# Altium schematic sheet Filters.SchDoc: Sample Sheet Title
size B; Date: MM/DD/YYYY; Author: Sample Author; Organization: ORGANIZATION; Address1: ADDRESS 1; Address2: ADDRESS 2; Address3: ADDRESS 3; Address4: ADDRESS 4; Revision: -; SheetNumber: 2; SheetTotal: 2; ENG_APP_DATE: --/--/--; DSN_APP_DATE: --/--/--; CHK_APP_DATE: --/--/--
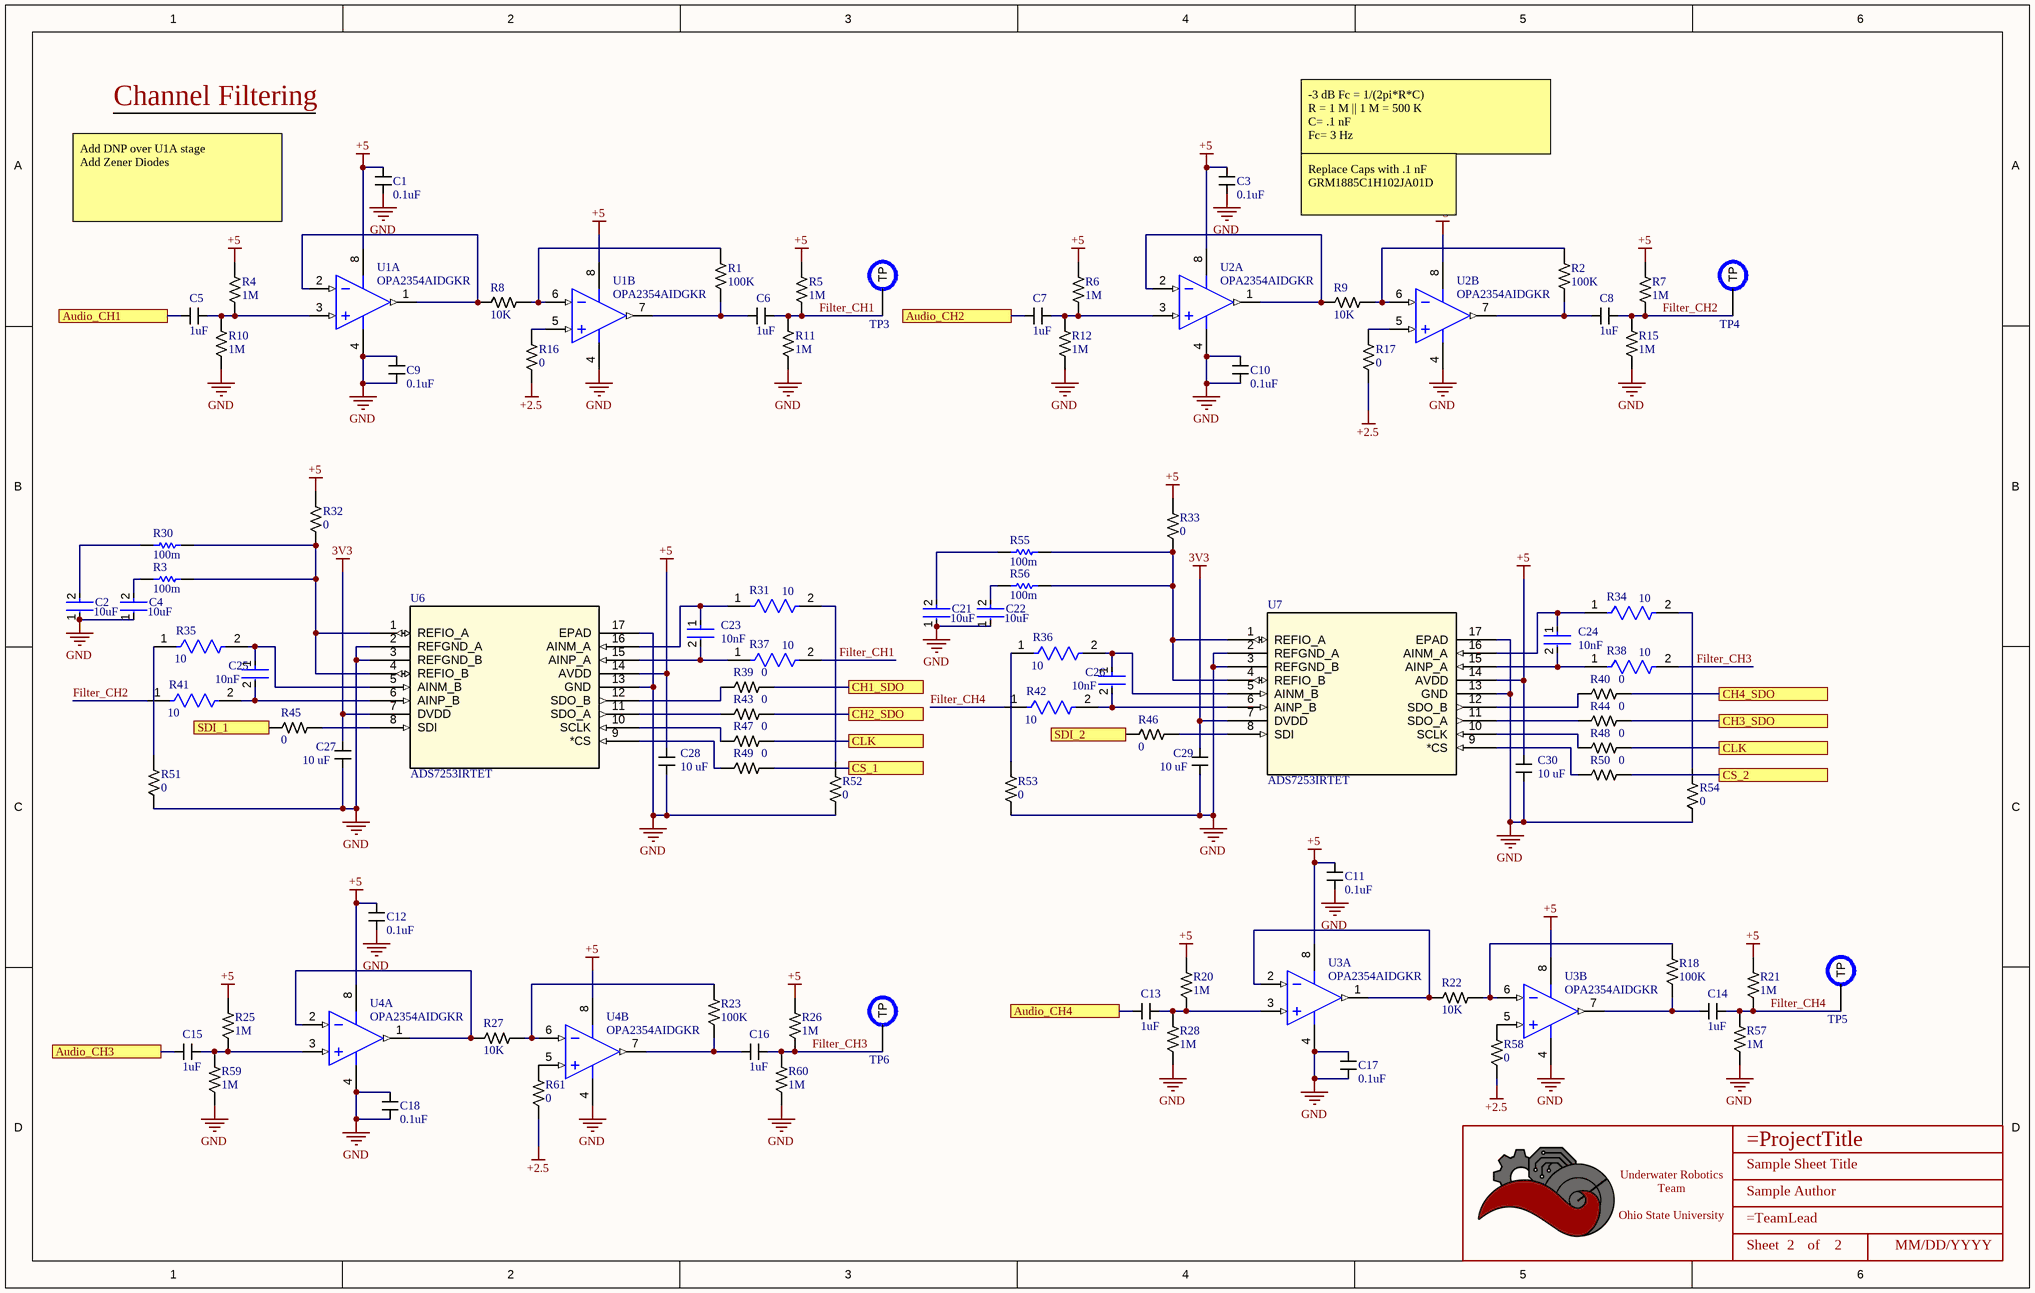
[diagram p0: Filters.SchDoc]

## Parts
*  Title_Block  [LOGO]  (value not drawn)  (graphical)
C1  value 0.1uF  [CAPACITOR_0603]  (hidden comment: 100nF Ceramic 25V)
C2  value 10uF  [FP-CL21B106KOQNNNE-MFG]  (hidden comment: CL21B106KOQNNNE)
C3  value 0.1uF  [CAPACITOR_0603]  (hidden comment: 100nF Ceramic 25V)
C4  value 10uF  [FP-CL21B106KOQNNNE-MFG]  (hidden comment: CL21B106KOQNNNE)
C5  value 1uF  [CAPACITOR_0603]  (hidden comment: 1uF Ceramic 16V)
C6  value 1uF  [CAPACITOR_0603]  (hidden comment: 1uF Ceramic 16V)
C7  value 1uF  [CAPACITOR_0603]  (hidden comment: 1uF Ceramic 16V)
C8  value 1uF  [CAPACITOR_0603]  (hidden comment: 1uF Ceramic 16V)
C9  value 0.1uF  [CAPACITOR_0603]  (hidden comment: 100nF Ceramic 25V)
C10  value 0.1uF  [CAPACITOR_0603]  (hidden comment: 100nF Ceramic 25V)
C11  value 0.1uF  [CAPACITOR_0603]  (hidden comment: 100nF Ceramic 25V)
C12  value 0.1uF  [CAPACITOR_0603]  (hidden comment: 100nF Ceramic 25V)
C13  value 1uF  [CAPACITOR_0603]  (hidden comment: 1uF Ceramic 16V)
C14  value 1uF  [CAPACITOR_0603]  (hidden comment: 1uF Ceramic 16V)
C15  value 1uF  [CAPACITOR_0603]  (hidden comment: 1uF Ceramic 16V)
C16  value 1uF  [CAPACITOR_0603]  (hidden comment: 1uF Ceramic 16V)
C17  value 0.1uF  [CAPACITOR_0603]  (hidden comment: 100nF Ceramic 25V)
C18  value 0.1uF  [CAPACITOR_0603]  (hidden comment: 100nF Ceramic 25V)
C21  value 10uF  [FP-CL21B106KOQNNNE-MFG]  (hidden comment: CL21B106KOQNNNE)
C22  value 10uF  [FP-CL21B106KOQNNNE-MFG]  (hidden comment: CL21B106KOQNNNE)
C23  Capacitance: 10nF  [FP-GRM219-0_1-IPC_B]  (hidden comment: GRM2195C1H103JA01D)
C24  Capacitance: 10nF  [FP-GRM219-0_1-IPC_B]  (hidden comment: GRM2195C1H103JA01D)
C25  Capacitance: 10nF  [FP-GRM219-0_1-IPC_B]  (hidden comment: GRM2195C1H103JA01D)
C26  Capacitance: 10nF  [FP-GRM219-0_1-IPC_B]  (hidden comment: GRM2195C1H103JA01D)
C27  Value (uF): 10 uF  [CAPACITOR_0603]  (hidden comment: 10uF Ceramic 6.3V)
C28  Value (uF): 10 uF  [CAPACITOR_0603]  (hidden comment: 10uF Ceramic 6.3V)
C29  Value (uF): 10 uF  [CAPACITOR_0603]  (hidden comment: 10uF Ceramic 6.3V)
C30  Value (uF): 10 uF  [CAPACITOR_0603]  (hidden comment: 10uF Ceramic 6.3V)
R1  Value  (Ohms): 100K  [RESISTOR_0402]  (hidden comment: 100k Ohm 1% 1/16W)
R2  Value  (Ohms): 100K  [RESISTOR_0402]  (hidden comment: 100k Ohm 1% 1/16W)
R3  100m  [RESC1005X40X25NL10T10]
R4  Value  (Ohms): 1M  [RESISTOR_0402]  (hidden comment: 1M Ohm 1% 1/16W)
R5  Value  (Ohms): 1M  [RESISTOR_0402]  (hidden comment: 1M Ohm 1% 1/16W)
R6  Value  (Ohms): 1M  [RESISTOR_0402]  (hidden comment: 1M Ohm 1% 1/16W)
R7  Value  (Ohms): 1M  [RESISTOR_0402]  (hidden comment: 1M Ohm 1% 1/16W)
R8  Value  (Ohms): 10K  [RESISTOR_0402]  (hidden comment: 10k Ohm 1% 1/16W)
R9  Value  (Ohms): 10K  [RESISTOR_0402]  (hidden comment: 10k Ohm 1% 1/16W)
R10  Value  (Ohms): 1M  [RESISTOR_0402]  (hidden comment: 1M Ohm 1% 1/16W)
R11  Value  (Ohms): 1M  [RESISTOR_0402]  (hidden comment: 1M Ohm 1% 1/16W)
R12  Value  (Ohms): 1M  [RESISTOR_0402]  (hidden comment: 1M Ohm 1% 1/16W)
R15  Value  (Ohms): 1M  [RESISTOR_0402]  (hidden comment: 1M Ohm 1% 1/16W)
R16  Value  (Ohms): 0  [RESISTOR_0402]  (hidden comment: 0 Ohm 1% 1/16W)
R17  Value  (Ohms): 0  [RESISTOR_0402]  (hidden comment: 0 Ohm 1% 1/16W)
R18  Value  (Ohms): 100K  [RESISTOR_0402]  (hidden comment: 100k Ohm 1% 1/16W)
R20  Value  (Ohms): 1M  [RESISTOR_0402]  (hidden comment: 1M Ohm 1% 1/16W)
R21  Value  (Ohms): 1M  [RESISTOR_0402]  (hidden comment: 1M Ohm 1% 1/16W)
R22  Value  (Ohms): 10K  [RESISTOR_0402]  (hidden comment: 10k Ohm 1% 1/16W)
R23  Value  (Ohms): 100K  [RESISTOR_0402]  (hidden comment: 100k Ohm 1% 1/16W)
R25  Value  (Ohms): 1M  [RESISTOR_0402]  (hidden comment: 1M Ohm 1% 1/16W)
R26  Value  (Ohms): 1M  [RESISTOR_0402]  (hidden comment: 1M Ohm 1% 1/16W)
R27  Value  (Ohms): 10K  [RESISTOR_0402]  (hidden comment: 10k Ohm 1% 1/16W)
R28  Value  (Ohms): 1M  [RESISTOR_0402]  (hidden comment: 1M Ohm 1% 1/16W)
R30  100m  [RESC1005X40X25NL10T10]
R31  Resistance: 10  [FP-RMCF0603-MFG]  (hidden comment: RMCF0603FT10R0)
R32  Value  (Ohms): 0  [RESISTOR_0402]  (hidden comment: 0 Ohm 1% 1/16W)
R33  Value  (Ohms): 0  [RESISTOR_0402]  (hidden comment: 0 Ohm 1% 1/16W)
R34  Resistance: 10  [FP-RMCF0603-MFG]  (hidden comment: RMCF0603FT10R0)
R35  Resistance: 10  [FP-RMCF0603-MFG]  (hidden comment: RMCF0603FT10R0)
R36  Resistance: 10  [FP-RMCF0603-MFG]  (hidden comment: RMCF0603FT10R0)
R37  Resistance: 10  [FP-RMCF0603-MFG]  (hidden comment: RMCF0603FT10R0)
R38  Resistance: 10  [FP-RMCF0603-MFG]  (hidden comment: RMCF0603FT10R0)
R39  Value  (Ohms): 0  [RESISTOR_0402]  (hidden comment: 0 Ohm 1% 1/16W)
R40  Value  (Ohms): 0  [RESISTOR_0402]  (hidden comment: 0 Ohm 1% 1/16W)
R41  Resistance: 10  [FP-RMCF0603-MFG]  (hidden comment: RMCF0603FT10R0)
R42  Resistance: 10  [FP-RMCF0603-MFG]  (hidden comment: RMCF0603FT10R0)
R43  Value  (Ohms): 0  [RESISTOR_0402]  (hidden comment: 0 Ohm 1% 1/16W)
R44  Value  (Ohms): 0  [RESISTOR_0402]  (hidden comment: 0 Ohm 1% 1/16W)
R45  Value  (Ohms): 0  [RESISTOR_0402]  (hidden comment: 0 Ohm 1% 1/16W)
R46  Value  (Ohms): 0  [RESISTOR_0402]  (hidden comment: 0 Ohm 1% 1/16W)
R47  Value  (Ohms): 0  [RESISTOR_0402]  (hidden comment: 0 Ohm 1% 1/16W)
R48  Value  (Ohms): 0  [RESISTOR_0402]  (hidden comment: 0 Ohm 1% 1/16W)
R49  Value  (Ohms): 0  [RESISTOR_0402]  (hidden comment: 0 Ohm 1% 1/16W)
R50  Value  (Ohms): 0  [RESISTOR_0402]  (hidden comment: 0 Ohm 1% 1/16W)
R51  Value  (Ohms): 0  [RESISTOR_0402]  (hidden comment: 0 Ohm 1% 1/16W)
R52  Value  (Ohms): 0  [RESISTOR_0402]  (hidden comment: 0 Ohm 1% 1/16W)
R53  Value  (Ohms): 0  [RESISTOR_0402]  (hidden comment: 0 Ohm 1% 1/16W)
R54  Value  (Ohms): 0  [RESISTOR_0402]  (hidden comment: 0 Ohm 1% 1/16W)
R55  100m  [RESC1005X40X25NL10T10]
R56  100m  [RESC1005X40X25NL10T10]
R57  Value  (Ohms): 1M  [RESISTOR_0402]  (hidden comment: 1M Ohm 1% 1/16W)
R58  Value  (Ohms): 0  [RESISTOR_0402]  (hidden comment: 0 Ohm 1% 1/16W)
R59  Value  (Ohms): 1M  [RESISTOR_0402]  (hidden comment: 1M Ohm 1% 1/16W)
R60  Value  (Ohms): 1M  [RESISTOR_0402]  (hidden comment: 1M Ohm 1% 1/16W)
R61  Value  (Ohms): 0  [RESISTOR_0402]  (hidden comment: 0 Ohm 1% 1/16W)
TP3  PCB Test Point  [TESTPOINT_1.2MM]  (value not drawn)  (no BOM)
TP4  PCB Test Point  [TESTPOINT_1.2MM]  (value not drawn)  (no BOM)
TP5  PCB Test Point  [TESTPOINT_1.2MM]  (value not drawn)  (no BOM)
TP6  PCB Test Point  [TESTPOINT_1.2MM]  (value not drawn)  (no BOM)
U1  OPA2354AIDGKR  [DGK0008A_M]  (parts A,B of 2)
U2  OPA2354AIDGKR  [DGK0008A_M]  (parts A,B of 2)
U3  OPA2354AIDGKR  [DGK0008A_M]  (parts A,B of 2)
U4  OPA2354AIDGKR  [DGK0008A_M]  (parts A,B of 2)
U6  ADS7253IRTET  [WQFN-16]
U7  ADS7253IRTET  [WQFN-16]

## Ports
Audio_CH1, Audio_CH2, Audio_CH3, Audio_CH4, CH1_SDO, CH2_SDO, CH3_SDO, CH4_SDO, CLK, CS_1, CS_2, SDI_1, SDI_2

## Nets
3V3: C27.2 C29.2 U6.7(DVDD) U7.7(DVDD)
+2.5: R16.2 R17.2 R58.2 R61.2
+5: C1.1 C3.1 C11.1 C12.1 C28.2 C30.2 R4.1 R5.1 R6.1 R7.1 R20.1 R21.1 R25.1 R26.1 R32.1 R33.1 U1.8(V+) U2.8(V+) U3.8(V+) U4.8(V+) U6.14(AVDD) U7.14(AVDD)
GND: C1.2 C2.1 C3.2 C4.1 C9.1 C9.2 C10.1 C10.2 C11.2 C12.2 C17.1 C17.2 C18.1 C18.2 C21.1 C22.1 C27.1 C28.1 C29.1 C30.1 R10.2 R11.2 R12.2 R15.2 R28.2 R51.2 R52.2 R53.2 R54.2 R57.2 R59.2 R60.2 U1.4(V-) U2.4(V-) U3.4(V-) U4.4(V-) U6.2(REFGND_A) U6.3(REFGND_B) U6.13(GND) U6.17(EPAD) U7.2(REFGND_A) U7.3(REFGND_B) U7.13(GND) U7.17(EPAD)
Audio_CH1: C5.2 ; port Audio_CH1
Audio_CH2: C7.2 ; port Audio_CH2
Audio_CH3: C15.2 ; port Audio_CH3
Audio_CH4: C13.2 ; port Audio_CH4
CH1_SDO: R39.1 ; port CH1_SDO
CH2_SDO: R43.1 ; port CH2_SDO
CH3_SDO: R44.1 ; port CH3_SDO
CH4_SDO: R40.1 ; port CH4_SDO
CLK: R47.1 R48.1 ; port CLK
CS_1: R49.1 ; port CS_1
CS_2: R50.1 ; port CS_2
Filter_CH1: C6.1 R5.2 R11.1 R37.2 TP3.TP
Filter_CH2: C8.1 R7.2 R15.1 R41.1 TP4.TP
Filter_CH3: C16.1 R26.2 R38.2 R60.1 TP6.TP
Filter_CH4: C14.1 R21.2 R42.1 R57.1 TP5.TP
SDI_1: R45.2 ; port SDI_1
SDI_2: R46.2 ; port SDI_2
NetC2_2: C2.2 R30.2
NetC4_2: C4.2 R3.2
NetC5_1: C5.1 R4.2 R10.1 U1.3(IN_A+)
NetC6_2: C6.2 R1.2 U1.7(OUT_B)
NetC7_1: C7.1 R6.2 R12.1 U2.3(IN_A+)
NetC8_2: C8.2 R2.2 U2.7(OUT_B)
NetC13_1: C13.1 R20.2 R28.1 U3.3(IN_A+)
NetC14_2: C14.2 R18.2 U3.7(OUT_B)
NetC15_1: C15.1 R25.2 R59.1 U4.3(IN_A+)
NetC16_2: C16.2 R23.2 U4.7(OUT_B)
NetC21_2: C21.2 R55.2
NetC22_2: C22.2 R56.2
NetC23_1: C23.1 R31.1 U6.16(AINM_A)
NetC23_2: C23.2 R37.1 U6.15(AINP_A)
NetC24_1: C24.1 R34.1 U7.16(AINM_A)
NetC24_2: C24.2 R38.1 U7.15(AINP_A)
NetC25_1: C25.1 R35.2 U6.5(AINM_B)
NetC25_2: C25.2 R41.2 U6.6(AINP_B)
NetC26_1: C26.1 R36.2 U7.5(AINM_B)
NetC26_2: C26.2 R42.2 U7.6(AINP_B)
NetR1_1: R1.1 R8.1 U1.6(IN_B-)
NetR2_1: R2.1 R9.1 U2.6(IN_B-)
NetR3_1: R3.1 R30.1 R32.2 U6.1(REFIO_A) U6.4(REFIO_B)
NetR8_2: R8.2 U1.1(OUT_A) U1.2(IN_A-)
NetR9_2: R9.2 U2.1(OUT_A) U2.2(IN_A-)
NetR16_1: R16.1 U1.5(IN_B+)
NetR17_1: R17.1 U2.5(IN_B+)
NetR18_1: R18.1 R22.1 U3.6(IN_B-)
NetR22_2: R22.2 U3.1(OUT_A) U3.2(IN_A-)
NetR23_1: R23.1 R27.1 U4.6(IN_B-)
NetR27_2: R27.2 U4.1(OUT_A) U4.2(IN_A-)
NetR31_2: R31.2 R52.1
NetR33_2: R33.2 R55.1 R56.1 U7.1(REFIO_A) U7.4(REFIO_B)
NetR34_2: R34.2 R54.1
NetR35_1: R35.1 R51.1
NetR36_1: R36.1 R53.1
NetR39_2: R39.2 U6.12(SDO_B)
NetR40_2: R40.2 U7.12(SDO_B)
NetR43_2: R43.2 U6.11(SDO_A)
NetR44_2: R44.2 U7.11(SDO_A)
NetR45_1: R45.1 U6.8(SDI)
NetR46_1: R46.1 U7.8(SDI)
NetR47_2: R47.2 U6.10(SCLK)
NetR48_2: R48.2 U7.10(SCLK)
NetR49_2: R49.2 U6.9(*CS)
NetR50_2: R50.2 U7.9(*CS)
NetR58_1: R58.1 U3.5(IN_B+)
NetR61_1: R61.1 U4.5(IN_B+)

## Notes on the sheet
- Channel Filtering
- -3 dB Fc = 1/(2pi*R*C)
  R = 1 M || 1 M = 500 K
  C= .1 nF
  Fc= 3 Hz
- Add DNP over U1A stage
  Add Zener Diodes
- Replace Caps with .1 nF
  GRM1885C1H102JA01D
- DWG. NO.
- REV.
- SHT.
- THIS DOCUMENT AND THE DATA DISCLOSED HEREIN OR HEREWITH IS THE PROPERTY OF ALTIUM LIMITED AND MAY BE FREELY DISTRIBUTED IN WHOLE. NO RIGHTS ARE RESERVED OR EXPRESS OR IMPLIED WARANTEE GIVEN.
- REVISION
- DESCRIPTION
- DATE
- APPROVED
- ENG:
- APPROVALS
- PROJECT
- DSN:
- CHK:
- REFERENCE DOCUMENTS
- PROJECT REVISION:
- TITLE
- DOCUMENT REVISION:
- DESIGN ITEM:
- BOM:
- FAB DWG:
- PCB DWG:
- ASSY DWG:
- SCALE:
- SIZE
- B
- CAGE CODE
- FILE NAME
- DWG NO.
- SHEET
- OF
- REV
- (in symbol Title_Block) Underwater Robotics Team / Ohio State University; Sheet; of

## Library data of the parts
* = Title_Block: UWRT Schematic Title Block Template / Created June 2021, Dylan Trainor
C1 C3 C9-C12 C17 C18 = CAPACITOR_0.1uF_0603_25V: Cap 100nF 25V +/-10% / Ceramic 0603; Voltage: 6.3V; Made By: Flip B; ComponentLink1Description: Datsheet; ComponentLink1URL: https://www.mouser.com/datasheet/2/212/KEM_C1002_X7R_SMD-1102033.pdf; Tolerance: +/- 10%; Supplier 1: Digikey; Supplier Part Number 1: 1276-1006-1-ND
C2 C4 C21 C22 = CMP-2000-06106-2: CAP CER 10UF 16V X7R 0805; Manufacturer: Samsung Electro-Mechanics America, Inc; Material: Ceramic; Tolerance: 10%; Temperature Coefficient: 15%; Digikey Description: CAP CER 10UF 16V X7R 0805; Lead Free: Yes; ComponentLink2URL: http://www.samsungsem.com/servlet/FileDownload?path=productsearch&sname=CL21B106KOQNNNE.pdf&oname=CL21B106KOQNNNE.pdf; ComponentLink2Description: Datasheet; Temperature Range Low: -55°C; RoHS: TRUE; Category: Cap; Temperature Characteristic: X7R; Manufacturer Part Number: CL21B106KOQNNNE; Automotive: No; Octopart: https://octopart.com/cl21b106koqnnne-samsung-19832289; Device Class L3: Ceramic Capacitors; Temperature Range High: +125°C; Height: 1.4mm; Device Class L2: Capacitors; Voltage Rating: 16V; Temperature: -55°C to +125°C; Device Class L1: Passive Components; Ipc Land Pattern Name: CAPC200125X125; Package: CL21B106KOQNNNE; Capacitance: 10uF
C5-C8 C13-C16 = CAPACITOR_1uF_0603: Cap 1uF 16V +/-10% / Ceramic 0603; Made By: Flip B; Tolerance: +/- 10%; Voltage: 16V; Supplier 1: Arrow Electronics; Supplier Part Number 1: C1608X7R1C105K080AC
C23-C26 = CMP-2007-00135-2: Chip Multilayer Ceramic Capacitors for General Purpose, 0805, 10000pF, C0G, 30ppm/°C, 5%, 50V; Insulation Resistance: 10GR; Max Operating Temperature: 125°C; Height: 0.85mm; Voltage: 50V; Dielectric Material: Ceramic; Voltage Rating: 50V; Dielectric: C0G; Thickness: 0.037inch; REACH SVHC: No SVHC; Lead Free: Lead Free; Depth: 1.25mm; Min Operating Temperature: -55°C; Package Quantity: 1; Packaging: Tape and Reel; Case Code (Imperial): 0805; Case/Package: 0805; Mount: Surface Mount; Width: 0.049inch; Case Code (Metric): 2012; Length: 2mm; Termination: SMD/SMT; Material: Ceramic; Tolerance: 5%; Temperature Coefficient: 30ppm/°C; Number of Pins: 2; Voltage Rating (DC): 50V; Radiation Hardening: No
C27-C30 = CAPACITOR_10uF_0603: Cap 10uF 6.3V +/-20% / Ceramic 0603; Made By: Flip B; ComponentLink1Description: Digikey; ComponentLink1URL: https://www.digikey.com/en/products/detail/samsung-electro-mechanics/CL10A106MQ8NNNC/3886777; Supplier 1: Digi-Key; Supplier Part Number 1: 1276-1119-1-ND; Tolerance: +/- 20%; Voltage: 6.3V
R1 R2 R18 R23 = RESISTOR_100K_0402: RES 100k OHM 1% 1/16W 0402; Tolerance: +/- 1%; Made By: Robert Pafford; Wattage: 1/16W; Supplier 1: Digikey; Supplier Part Number 1: YAG3434CT-ND
R3 R30 R55 R56 = CMP-2002-06400-1: Manufacturer: Yageo; Part Number: RL0402JR-070R1L
R4-R7 R10-R12 R15 R20 R21 R25 R26 R28 R57 R59 R60 = RESISTOR_1M_0402: RES 1M OHM 1% 1/16W 0402; Tolerance: +/- 1%; Made By: Robert Pafford; Wattage: 1/16W; Supplier 1: Digikey; Supplier Part Number 1: YAG3450CT-ND
R8 R9 R22 R27 = RESISTOR_10K_0402: RES 10k OHM 1% 1/16W 0402; Tolerance: +/- 1%; Made By: Robert Pafford; Wattage: 1/16W; Supplier: Digikey; Digikey Part Numer: CR0603-JW-104ELFTR-ND; Supplier 1: Digi-Key; Supplier Part Number 1: YAG3436CT-ND
R16 R17 R32 R33 R39 R40 R43-R54 R58 R61 = RESISTOR_0_0402: RES 0 OHM 1% 1/16W 0402; Tolerance: +/- 1%; Made By: Robert Pafford; Wattage: 1/16W; Supplier 1: Digikey; Supplier Part Number 1: 13-AC0402FR-070RLCT-ND
R31 R34-R38 R41 R42 = CMP-26527-005040-1: 10Ω ±1% 0.1W 0603 Thick Film Chip Resistor AEC-Q200 compliant; Max Power Dissipation: 100mW; Temperature Coefficient: 100ppm/°C; Radiation Hardening: No; Military Standard: Not; Resistor Type: Thick Film; Case/Package: 0603; Case Code (Metric): 1608; Power Rating: 100mW; Min Operating Temperature: -55°C; Mount: Surface Mount; Width: 0.031inch; Packaging: Tape and Reel; Tolerance: 1%; Case Code (Imperial): 0603; Number of Terminations: 2; Height: 0.022inch; Features: Automotive AEC-Q200; Construction: Rectangular; Contact Plating: Tin; RoHS Compliant: Yes; Length: 1.55mm; Max Operating Temperature: 155°C; Depth: 0.8mm; Series: RMCF
TP3-TP6 = TESTPOINT: Made By: Robert Pafford
U1-U4 = CMP-0018-00600-2: 250 MHz, Rail-to-Rail I/O, CMOS Dual Operational Amplifier, 2.7 to 5.5 V, -40 to 125 degC, 8-pin SOP (DGK8), Green (RoHS & no Sb/Br); Manufacturer: Texas Instruments; Slew Rate(Typ)(V/us): 150; Acl, min stable gain(V/V): 1; 3rd Harmonic(dBc): 83; Iq per channel(Max)(mA): 7.5; Vs(Max)(V): 5.5; Vn at Flatband(Typ)(nV/rtHz): 6.5; Vio(Max)(mV): 8; Rail-Rail: In, Out; BW @ Acl(MHz): 250; THD (Fc is 1 MHz)(Typ)(dB): -73; Io(Typ)(mA): 100; Iib(Max)(nA): 0.05; Number of Channels: 2; Settling Time (0.1%)(Typ)(ns): 30; 2nd Harmonic(dBc): 75; Sub Family: High Output Current Amplifier (>=50mA), High Speed Amplifier (>=50MHz), Low Supply Voltage Amplifier (<=2.7V); Diff Phase(deg): 0.09; Vs(Min)(V): 2.7; Diff Gain(%): 0.02; Eco-Plan: Green (RoHS & no Sb/Br); ComponentLink3Description: Package Specification; PackageDescription: 8-Pin Thin Small Outline, Body 3 x 3 mm, Pitch 0.65 mm; Mounting Technology: Surface Mount; @ MHz: 1; Code_JEDEC: MO-187; PackageVersion: 4073329/E, 05/2006; ComponentLink1Description: Manufacturer URL; PartNumber: OPA2354AIDGKR; PackageReference: DGK0008A; ComponentLink2Description: Datasheet; ComponentLink1URL: http://www.ti.com/; DatasheetVersion: SBOS233E; ComponentLink3URL: http://www.ti.com/litv/pdf/mpds028d; ComponentLink2URL: http://www.ti.com/general/docs/lit/getliterature.tsp?genericPartNumber=OPA2354&fileType=pdf
U6 U7 = ADS7253IRTET: 12 Bit, 1 MSPS, Dual, Simultaneous Sampling Single Ended / Pseudo-Differential SAR ADC 16-WQFN -40 to 125; Manufacturer: TI; Max Sampling: 1 MSpS; Supplier 1: DigiKey; Supplier Part Number 1: 296-38482-1-ND; Created By: John Ulm